# Altium schematic sheet voltage_level_translators_schematic.SchDoc: Measurement and voltage translator ICs
size A2; DocumentNumber: 4; SheetNumber: 4; SheetTotal: 8
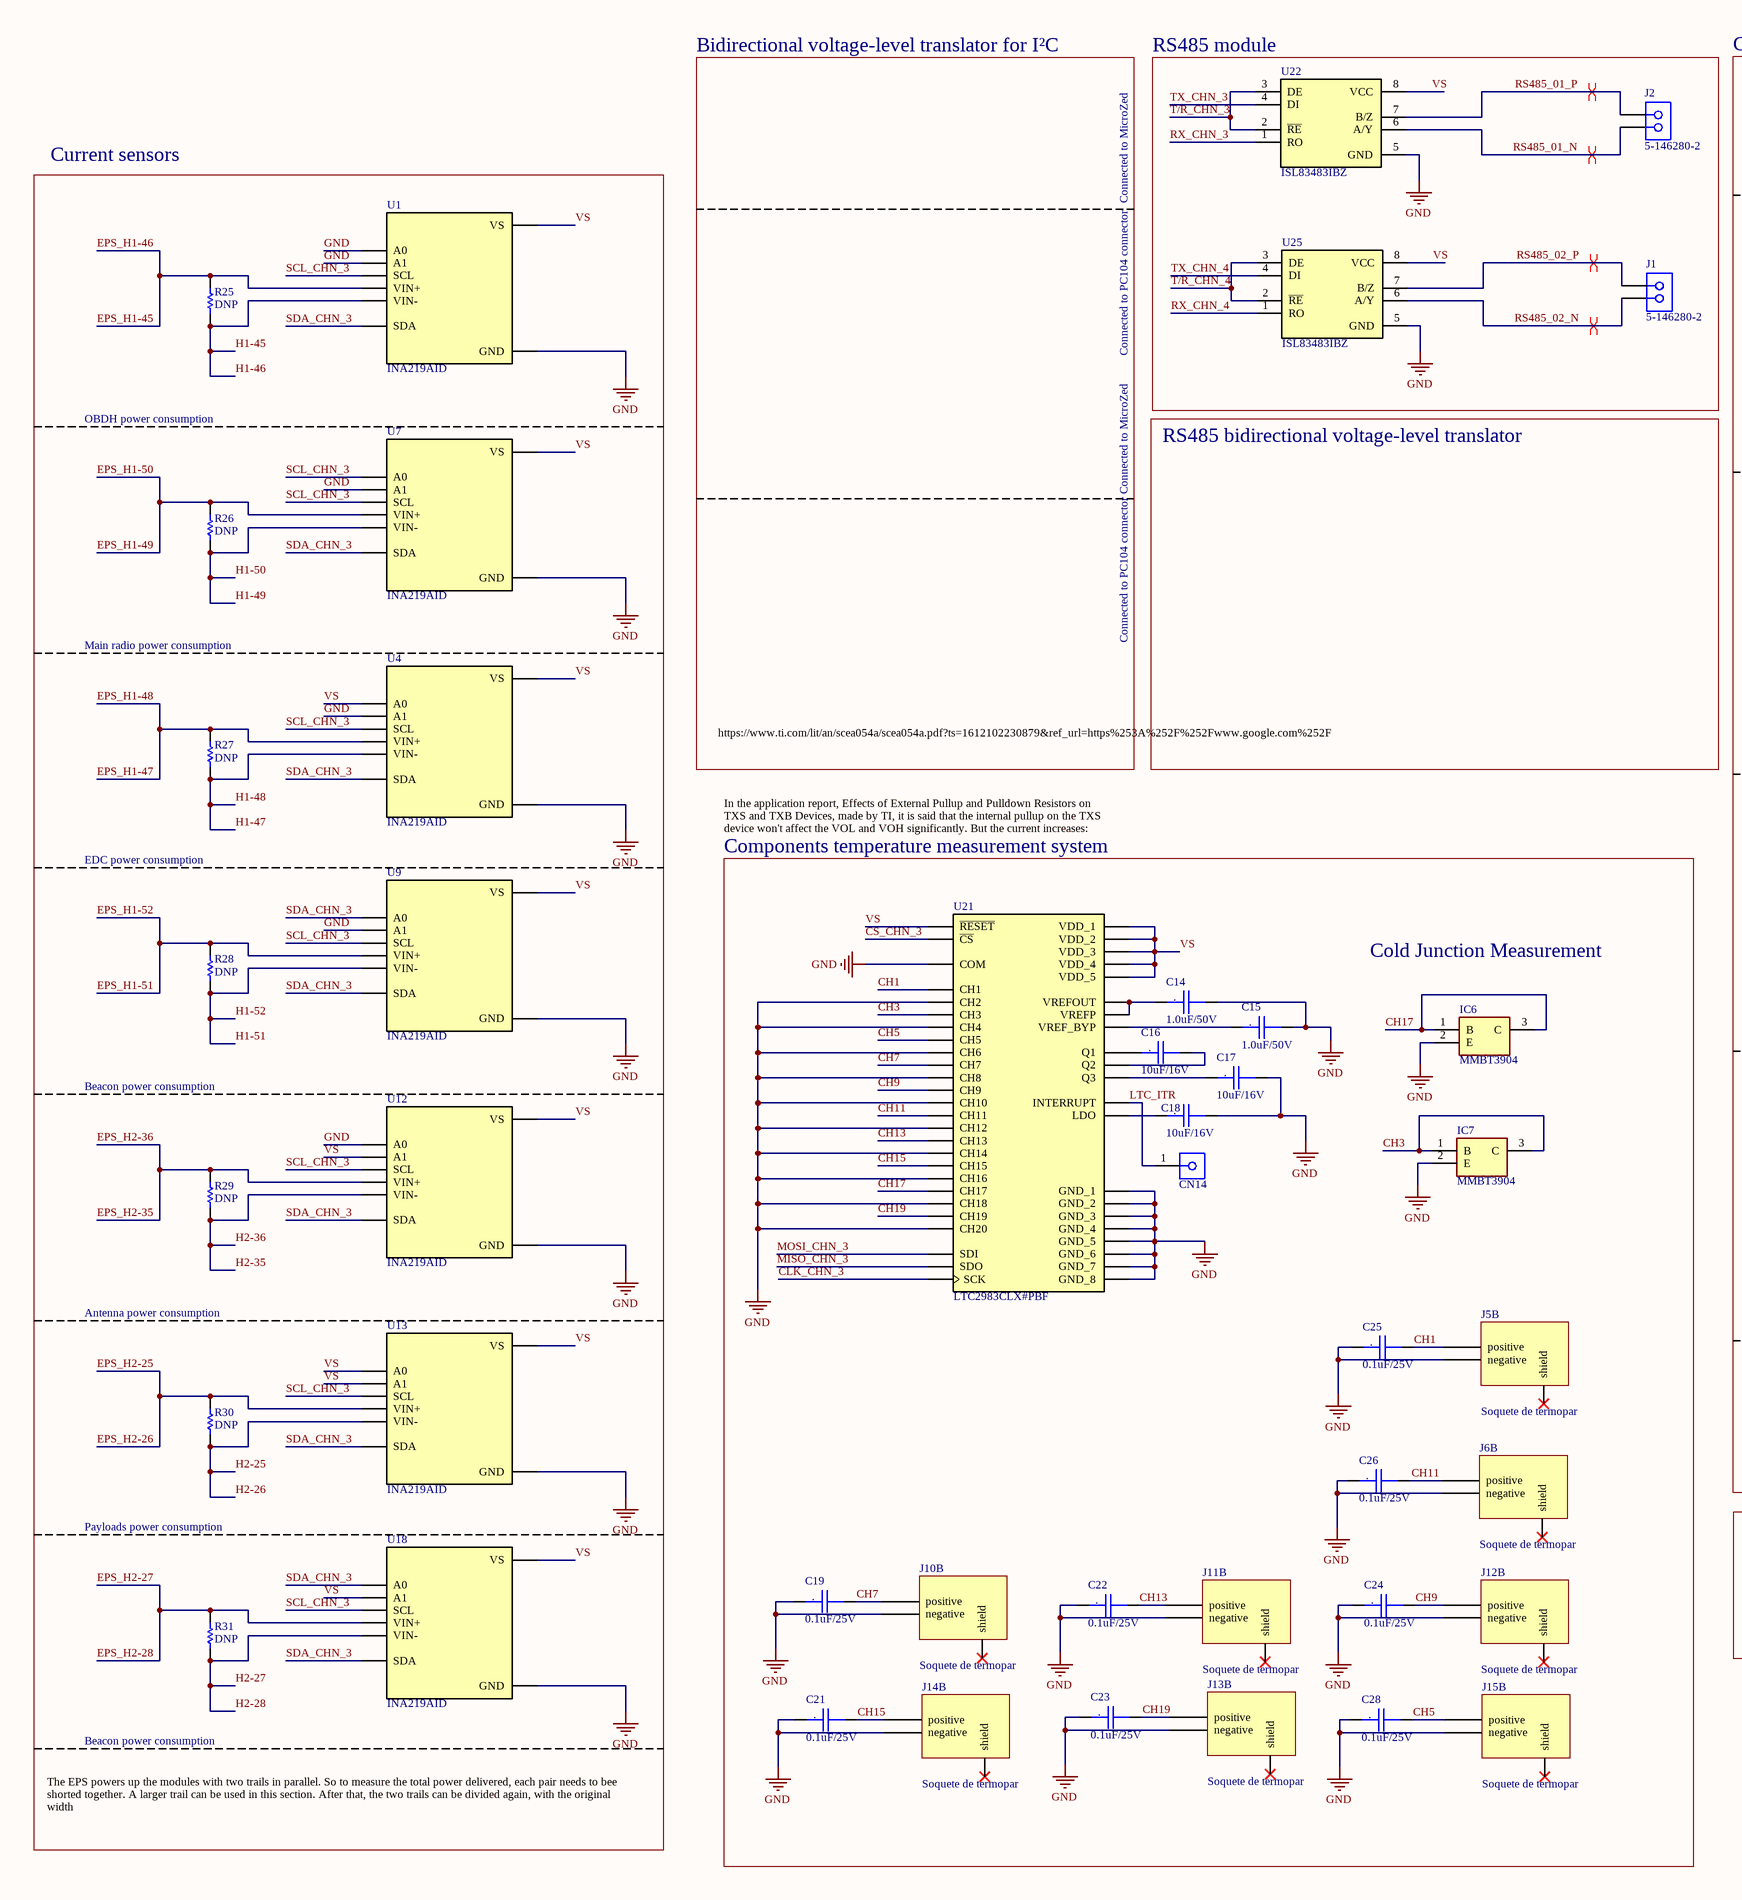
[diagram p0: voltage_level_translators_schematic.SchDoc, left]
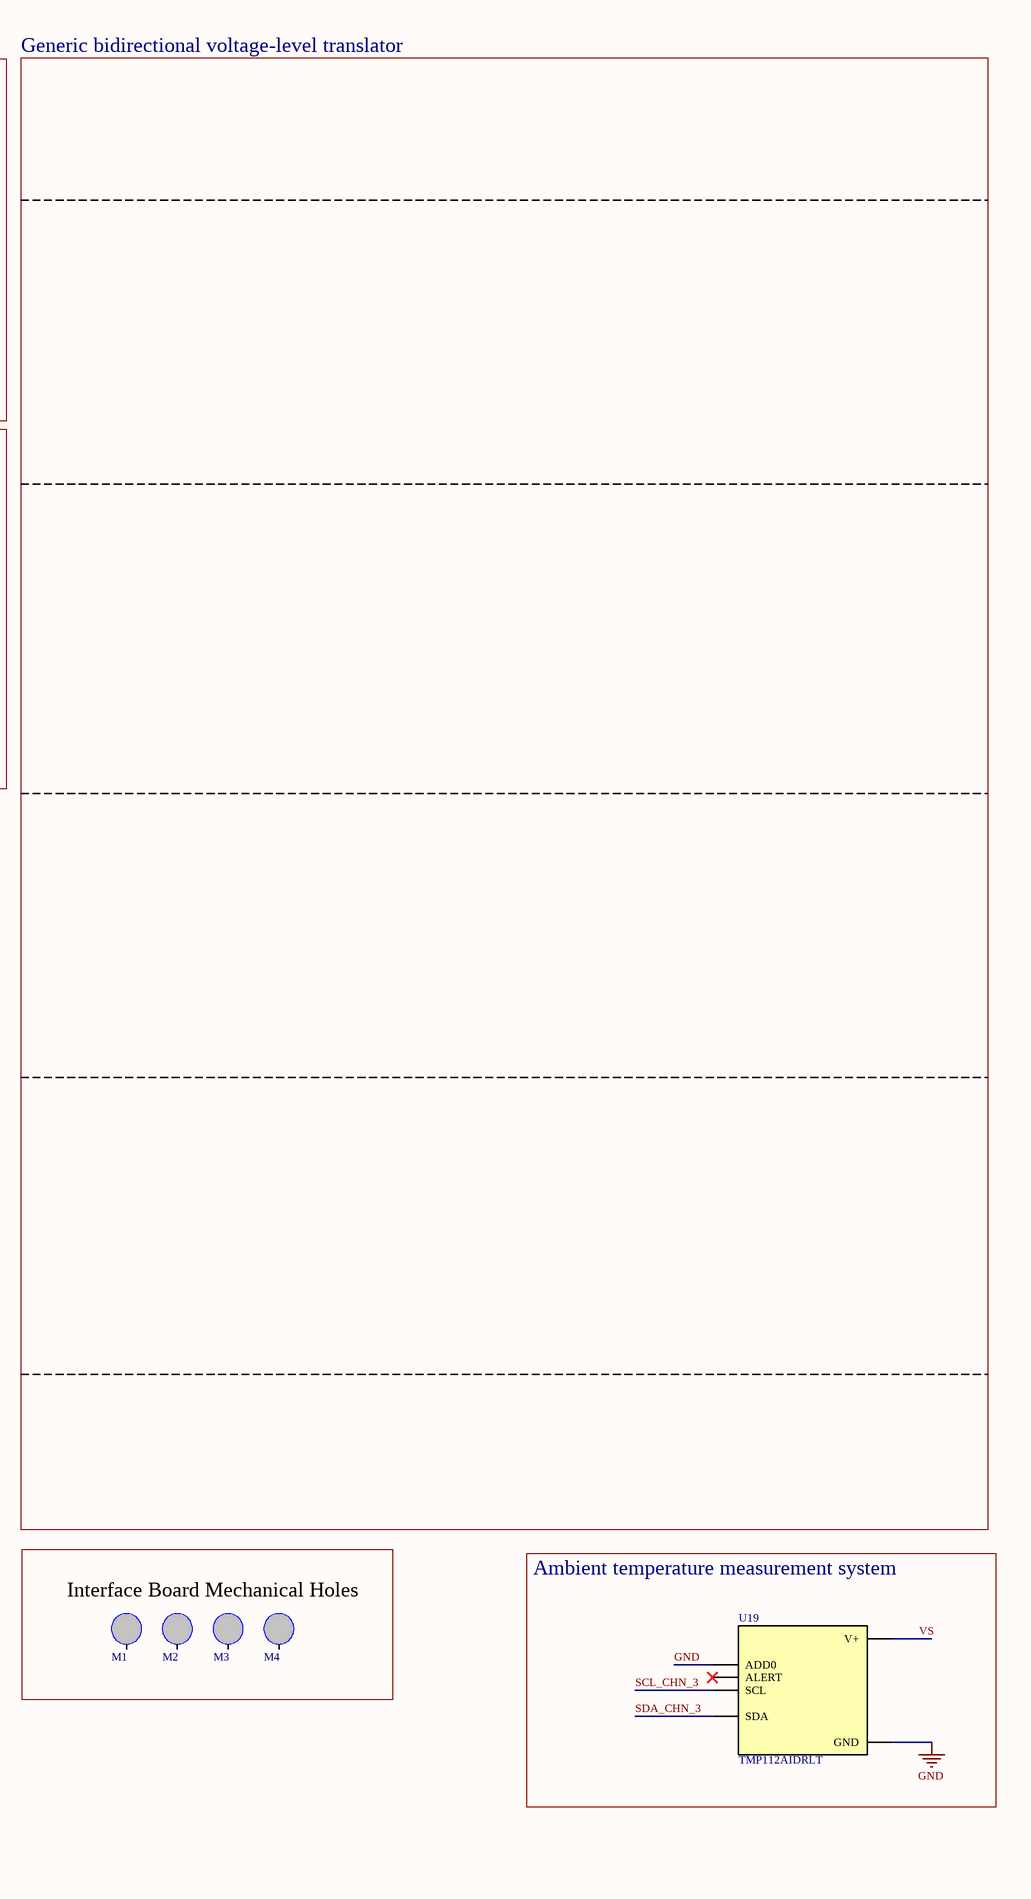
[diagram p1: voltage_level_translators_schematic.SchDoc, right]

## Parts
C14  1.0uF/50V  [CC0805]
C15  1.0uF/50V  [CC0805]
C16  10uF/16V  [CC1210]
C17  10uF/16V  [CC1210]
C18  10uF/16V  [CC1210]
C19  0.1uF/25V  [CC0805]
C21  0.1uF/25V  [CC0805]
C22  0.1uF/25V  [CC0805]
C23  0.1uF/25V  [CC0805]
C24  0.1uF/25V  [CC0805]
C25  0.1uF/25V  [CC0805]
C26  0.1uF/25V  [CC0805]
C28  0.1uF/25V  [CC0805]
CN14  TSW-101-05-T-S  [PIN BAR 1 2.54mm 180 GRAUS - Hide]  (value not drawn)
IC6  MMBT3904  [SOT95P240X120-3N]
IC7  MMBT3904  [SOT95P240X120-3N]
J1  5-146280-2  [PIN BAR 2 2.54mm 180 GRAUS]
J2  5-146280-2  [PIN BAR 2 2.54mm 180 GRAUS]
J5  Soquete de termopar  [PCC-SMP-V-K]  (part B of 2)
J6  Soquete de termopar  [PCC-SMP-V-K]  (part B of 2)
J10  Soquete de termopar  [PCC-SMP-V-K]  (part B of 2)
J11  Soquete de termopar  [PCC-SMP-V-K]  (part B of 2)
J12  Soquete de termopar  [PCC-SMP-V-K]  (part B of 2)
J13  Soquete de termopar  [PCC-SMP-V-K]  (part B of 2)
J14  Soquete de termopar  [PCC-SMP-V-K]  (part B of 2)
J15  Soquete de termopar  [PCC-SMP-V-K]  (part B of 2)
M1  IB Mechanical Hole  [M3 hole (5.5mm pad)]  (value not drawn)  (no BOM)
M2  IB Mechanical Hole  [M3 hole (5.5mm pad)]  (value not drawn)  (no BOM)
M3  IB Mechanical Hole  [M3 hole (5.5mm pad)]  (value not drawn)  (no BOM)
M4  IB Mechanical Hole  [M3 hole (5.5mm pad)]  (value not drawn)  (no BOM)
R25  DNP  [0805]
R26  DNP  [0805]
R27  DNP  [0805]
R28  DNP  [0805]
R29  DNP  [0805]
R30  DNP  [0805]
R31  DNP  [0805]
U1  INA219AID  [SOIC127P599X175-8N]
U4  INA219AID  [SOIC127P599X175-8N]
U7  INA219AID  [SOIC127P599X175-8N]
U9  INA219AID  [SOIC127P599X175-8N]
U12  INA219AID  [SOIC127P599X175-8N]
U13  INA219AID  [SOIC127P599X175-8N]
U18  INA219AID  [SOIC127P599X175-8N]
U19  TMP112AIDRLT  [SOT50P160X60-6N]
U21  LTC2983CLX#PBF  [QFP50P900X900X160-48N]
U22  ISL83483IBZ  [SOIC127P600X175-8N]
U25  ISL83483IBZ  [SOIC127P600X175-8N]

## Blocks framed on the sheet
RS485 module: J1 J2 U22 U25
Current sensors: R25-R31 U1 U4 U7 U9 U12 U13 U18
Interface Board Mechanical Holes: M1-M4
Ambient temperature measurement system: U19

## Nets
GND: C14.2 C15.2 C17.2 C18.2 C19.1 C21.1 C22.1 C23.1 C24.1 C25.1 C26.1 C28.1 IC6.2(E) IC7.2(E) J5.1(negative) J6.1(negative) J10.1(negative) J11.1(negative) J12.1(negative) J13.1(negative) J14.1(negative) J15.1(negative) U1.1(A1) U1.2(A0) U1.6(GND) U4.1(A1) U4.6(GND) U7.1(A1) U7.6(GND) U9.1(A1) U9.6(GND) U12.2(A0) U12.6(GND) U13.6(GND) U18.6(GND) U19.2(GND) U19.4(ADD0) U21.1(GND_1) U21.3(GND_2) U21.5(GND_3) U21.7(GND_4) U21.9(GND_5) U21.12(GND_6) U21.15(GND_7) U21.17(CH2) U21.19(CH4) U21.21(CH6) U21.23(CH8) U21.25(CH10) U21.27(CH12) U21.29(CH14) U21.31(CH16) U21.33(CH18) U21.35(CH20) U21.36(COM) U21.44(GND_8) U22.5(GND) U25.5(GND)
CH1: C25.2 J5.2(positive) U21.16(CH1)
CH3: IC7.1(B) IC7.3(C) U21.18(CH3)
CH5: C28.2 J15.2(positive) U21.20(CH5)
CH7: C19.2 J10.2(positive) U21.22(CH7)
CH9: C24.2 J12.2(positive) U21.24(CH9)
CH11: C26.2 J6.2(positive) U21.26(CH11)
CH13: C22.2 J11.2(positive) U21.28(CH13)
CH15: C21.2 J14.2(positive) U21.30(CH15)
CH17: IC6.1(B) IC6.3(C) U21.32(CH17)
CH19: C23.2 J13.2(positive) U21.34(CH19)
CLK_CHN_3: U21.38(SCK)
CS_CHN_3: U21.41(~{CS})
EPS_H1-45: R25.1 U1.8(VIN+)  [also labelled EPS_H1-46]
EPS_H1-47: R27.1 U4.8(VIN+)  [also labelled EPS_H1-48]
EPS_H1-49: R26.1 U7.8(VIN+)  [also labelled EPS_H1-50]
EPS_H1-51: R28.1 U9.8(VIN+)  [also labelled EPS_H1-52]
EPS_H2-25: R30.1 U13.8(VIN+)  [also labelled EPS_H2-26]
EPS_H2-27: R31.1 U18.8(VIN+)  [also labelled EPS_H2-28]
EPS_H2-35: R29.1 U12.8(VIN+)  [also labelled EPS_H2-36]
H1-45: R25.2 U1.7(VIN-)  [also labelled H1-46]
H1-47: R27.2 U4.7(VIN-)  [also labelled H1-48]
H1-49: R26.2 U7.7(VIN-)  [also labelled H1-50]
H1-51: R28.2 U9.7(VIN-)  [also labelled H1-52]
H2-25: R30.2 U13.7(VIN-)  [also labelled H2-26]
H2-27: R31.2 U18.7(VIN-)  [also labelled H2-28]
H2-35: R29.2 U12.7(VIN-)  [also labelled H2-36]
LTC_ITR: CN14.1 U21.37(INTERRUPT)
MISO_CHN_3: U21.39(SDO)
MOSI_CHN_3: U21.40(SDI)
RS485_01_N: J2.2 U22.6(A/Y)
RS485_01_P: J2.1 U22.7(B/Z)
RS485_02_N: J1.2 U25.6(A/Y)
RS485_02_P: J1.1 U25.7(B/Z)
RX_CHN_3: U22.1(RO)
RX_CHN_4: U25.1(RO)
SCL_CHN_3: U1.4(SCL) U4.4(SCL) U7.2(A0) U7.4(SCL) U9.4(SCL) U12.4(SCL) U13.4(SCL) U18.4(SCL) U19.1(SCL)
SDA_CHN_3: U1.3(SDA) U4.3(SDA) U7.3(SDA) U9.2(A0) U9.3(SDA) U12.3(SDA) U13.3(SDA) U18.2(A0) U18.3(SDA) U19.6(SDA)
T/R_CHN_3: U22.2(~{RE}) U22.3(DE)
T/R_CHN_4: U25.2(~{RE}) U25.3(DE)
TX_CHN_3: U22.4(DI)
TX_CHN_4: U25.4(DI)
VS: U1.5(VS) U4.2(A0) U4.5(VS) U7.5(VS) U9.5(VS) U12.1(A1) U12.5(VS) U13.1(A1) U13.2(A0) U13.5(VS) U18.1(A1) U18.5(VS) U19.5(V+) U21.2(VDD_1) U21.4(VDD_2) U21.6(VDD_3) U21.8(VDD_4) U21.42(~{RESET}) U21.45(VDD_5) U22.8(VCC) U25.8(VCC)
NetC14_1: C14.1 U21.13(VREFOUT) U21.14(VREFP)
NetC15_1: C15.1 U21.11(VREF_BYP)
NetC16_1: C16.1 U21.48(Q1)
NetC16_2: C16.2 U21.47(Q2)
NetC17_1: C17.1 U21.46(Q3)
NetC18_1: C18.1 U21.43(LDO)

Not connected (* = marked no-connect by the designer): J5 3(shield)*; J6 3(shield)*; J10 3(shield)*; J11 3(shield)*; J12 3(shield)*; J13 3(shield)*; J14 3(shield)*; J15 3(shield)*; M1 0; M2 0; M3 0; M4 0; U19 3(ALERT)*

## Layout directives
differential pair: RS485_01_N, RS485_01_P, RS485_02_N, RS485_02_P

## Notes on the sheet
- Bidirectional voltage-level translator for I²C
- Generic bidirectional voltage-level translator
- Connected to MicroZed
- Connected to PC104 connector
- OBDH power consumption
- RS485 bidirectional voltage-level translator
- Main radio power consumption
- https://www.ti.com/lit/an/scea054a/scea054a.pdf?ts=1612102230879&ref_url=https%253A%252F%252Fwww.google.com%252F
- In the application report, Effects of External Pullup and Pulldown Resistors on TXS and TXB Devices, made by TI, it is said that the internal pullup on the TXS device won't affect the VOL and VOH significantly. But the current increases:
- EDC power consumption
- Components temperature measurement system
- Cold Junction Measurement
- Beacon power consumption
- Antenna power consumption
- Payloads power consumption
- The EPS powers up the modules with two trails in parallel. So to measure the total power delivered, each pair needs to bee shorted together. A larger trail can be used in this section. After that, the two trails can be divided again, with the original width
- Title:
- Project:
- SpaceLab - Federal University of Santa Catarina
- Date:
- Engineer:
- Revision:
- Sheet
- of
- Project Code:
- Size:
- A2
- (in symbol Cap_Cer_X7R_0.1uF_25V_0805) .
- (in symbol Cap_Cer_X7R_1.0uF_50V_0805) .
- (in symbol Cap_Cer_X7R_10uF_16V_1210) .

## Library data of the parts
C14 C15 = Cap_Cer_X7R_1.0uF_50V_0805: CAP CER 1.0uF 50V 10% X7R 0805; Manufacturer Part Number: C0805X105K5RACAUTO; NCM: 8532.24.10
C16-C18 = Cap_Cer_X7R_10uF_16V_1210: CAP CER 10uF 16V 10% X7R 1210; Manufacturer Part Number: C1210C106K4RACTU; NCM: 8532.24.10
C19 C21-C26 C28 = Cap_Cer_X7R_0.1uF_25V_0805: CAP CER 0.1uF 25V 10% X7R 0805; Manufacturer Part Number: CC0805KRX7R8BB104; NCM: 8532.24.10
CN14 = TSW-101-05-T-S: CONN HEADER 1POS .100" SNGL TIN; Manufacturer: Samtec Inc; N of Positions: 2; Pitch: 2.54mm; Mount Type: PTH; Supplier 1: Farnell; Supplier Part Number 1: 1925384; Supplier 2: Newark; Supplier Part Number 2: 84T5043; Supplier 3: Digi-Key; Supplier Part Number 3: SAM1019-02-ND; Supplier 4: Arrow; Supplier Part Number 4: T9xGEsh_w6igb0LY4EP_nwsWhIkhCEmR3qLYTGm2XzA; Supplier 5: Digi-Key; Supplier Part Number 5: SAM1019-01-ND; Supplier 6: Newark; Supplier Part Number 6: 69X6269; Manufacturer Part Number: TSW-101-05-T-S
IC6 IC7 = MMBT3904: Integrated Circuit; Manufacturer_Name: Diotec; Datasheet Link: https://media.digikey.com/pdf/Data%20Sheets/ON%20Semiconductor%20PDFs/2N3904,MMBT3904,PZT3904.pdf; Height: 1.2mm; Manufacturer_Part_Number: MMBT3904; Mouser Part Number: 637-MMBT3904; Mouser Price/Stock: https://www.mouser.co.uk/ProductDetail/Diotec-Semiconductor/MMBT3904?qs=OlC7AqGiEDkK1MwiyUU6mg%3D%3D; Arrow Part Number: MMBT3904; Arrow Price/Stock: https://www.arrow.com/en/products/mmbt3904/diotec-semiconductor-ag?utm_currency=USD&region=europe
J1 J2 = 5-146280-2: 02 MODII HDR SRST B/A .100CL; MF: TE Connectivity; Product_Type: Connector; Number_of_Positions: 2; Centerline_Pitch: 2.54 mm[.1 in]; SnapEDA_Link: https://www.snapeda.com/parts/5-146280-2/TE%20Connectivity%20AMP%20Connectors/view-part/298520/?ref=snap; Price: None; EU_RoHS_Compliance: Compliant; Package: None; Availability: Unavailable; TE_purchase_URL: https://www.te.com/usa-en/product-5-146280-2.html?te_bu=Cor&te_type=disp&te_campaign=seda_glo_cor-seda-global-disp-prtnr-fy19-seda-model-bom-cta_sma-317_1&elqCampaignId=32493; Value: *; Manufacturer Part Number: 5-146280-2
J5 J6 J10-J15 = PCC-SMP-V-K: Soquete de termopar especial PCCS para placa de circuito em série; ComponentLink1Description: Datasheet; ComponentLink1URL: https://assets.omega.com/spec/PCC-OST-SMP_spec.pdf
M1-M4 = IB Mechanical Hole: Mechanical Hole for FloripaSat-2 interface boards
R25-R31 = RDNP_0805: RES DNP 0805; Manufacturer Part Number: UR73V2ATTD47L0F; NCM: 8533.21.20
U1 U4 U7 U9 U12 U13 U18 = INA219AID: 26V, 12-bit, i2c output current/voltage/power monitor 8-SOIC -40 to 125; MF: Texas Instruments; Purchase-URL: https://pricing.snapeda.com/search/part/INA219AID/?ref=eda; Package: SOIC-8 Texas Instruments; SnapEDA_Link: https://www.snapeda.com/parts/INA219AID/Texas%20Instruments/view-part/522322/?ref=snap; Value: *; Price: None; Availability: Warning; Check_prices: https://www.snapeda.com/parts/INA219AID/Texas%20Instruments/view-part/522322/?ref=eda; Manufacturer Part Number: INA219AID
U19 = TMP112AIDRLT: 0.5C 1.4V to 3.6V digital temperature sensor with I2C/SMBus in 2.56mm2 package 6-SOT-5X3 -40 to 125; MF: Texas Instruments; Texas_Instruments-Purchase-URL: https://snapeda.com/shop?store=Texas+Instruments&id=237309; Price: None; Mouser-Purchase-URL: https://snapeda.com/shop?store=Mouser&id=237309; Availability: Good; Package: SOT-5X3-6 Texas Instruments; SnapEDA_Link: https://www.snapeda.com/parts/TMP112AIDRLT/Texas%20Instruments/view-part/237309/?ref=snap; DigiKey-Purchase-URL: https://snapeda.com/shop?store=DigiKey&id=237309; Value: *; Manufacturer Part Number: TMP112AIDRLT
U21 = LTC2983CLX#PBF: IC SENSOR THERMAL; MF: Analog Devices; Value: *; SnapEDA_Link: https://www.snapeda.com/parts/LTC2983CLX%23PBF/Analog%20Devices/view-part/2895071/?ref=snap; Package: LQFP -48 Analog Devices; Manufacturer Part Number: LTC2983CLX#PBF
U22 U25 = ISL83483IBZ: 1/1 Transceiver Half RS422, RS485 8-SOIC; Manufacturer Part Number: ISL83483IBZ-T; MF: Renesas Electronics; Price: None; SnapEDA_Link: https://www.snapeda.com/parts/ISL83483IBZ-T/Renesas%20Electronics%20America%20Inc./view-part/482105/?ref=snap; Availability: Unavailable; Value: *; Package: SOIC-8 Intersil